# Altium schematic sheet Mechanics.SchDoc: Mechanics
size A4; Organization: Minbiocabanon Corp.; Address2: Kiwi road; Address3: Toulouse; Address4: FRANCE; DocumentNumber: 5; SheetNumber: 4; SheetTotal: 5
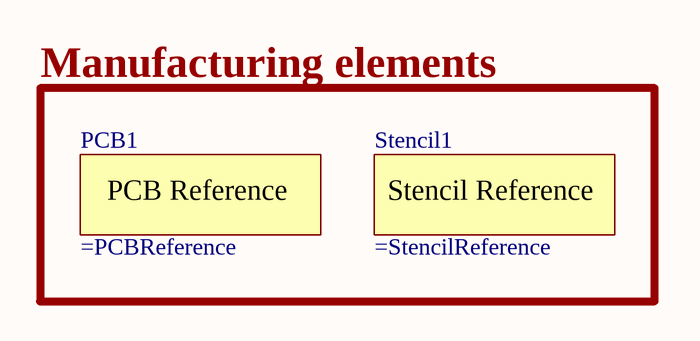
[diagram p0: Mechanics.SchDoc]

## Parts
PCB1  (no value)  (mechanical)
Stencil1  (no value)  (mechanical)

## Blocks framed on the sheet
Manufacturing elements: PCB1 Stencil1

## Notes on the sheet
- Projet:
- Title:
- Size:
- Date:
- A4
- PN:
- Revision:
- Page
- of
- Confidentiel - Les informations contenues dans ce document et tous les fichiers éventuellement attachés sont confidentiels.
- (in symbol =PCBReference) PCB Reference
- (in symbol =StencilReference) Stencil Reference

## Library data of the parts
PCB1 = =PCBReference: PCB reference; Manufacturer Part Number: =PCBReference; Component Type: BOARD_REFERENCE; Mounting Type: NONE
Stencil1 = =StencilReference: PCB stencil; Manufacturer Part Number: =StencilReference; Component Type: STENCIL; Mounting Type: NONE